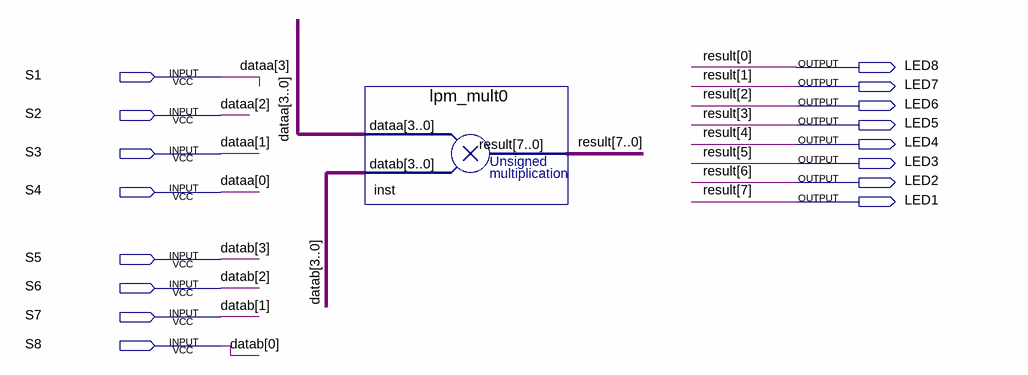
[diagram p0: schematic sheet]
// Quartus schematic Block2.bdf as structural Verilog: 1 symbols, 16 pins
module Block2 (
  input  S1,
  input  S2,
  input  S3,
  input  S4,
  input  S5,
  input  S6,
  input  S7,
  input  S8,
  output LED8,
  output LED7,
  output LED6,
  output LED5,
  output LED4,
  output LED3,
  output LED2,
  output LED1
);

  lpm_mult0 inst (
    .dataa({S1, S2, S3, S4}), .datab({S5, S6, S7, S8}),
    .result({LED1, LED2, LED3, LED4, LED5, LED6, LED7, LED8}));

  // Other names for the same wires on the sheet: dataa[3:0] = {S1, S2, S3, S4}; datab[3:0] = {S5, S6, S7, S8};
  //   result[7:0] = {LED1, LED2, LED3, LED4, LED5, LED6, LED7, LED8}
endmodule
